# EAGLE design C64 24-28 ROM Adapter NEW (EAGLE 9.6.2)
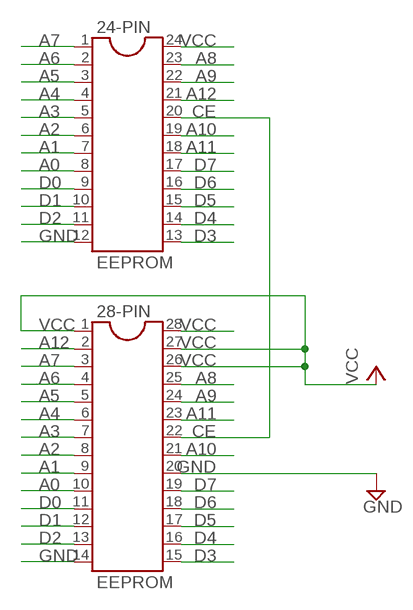
[diagram p0: schematic, sheet 1]

## Parts
24-PIN  EEPROM  DIL24-4  [DIL24-4]
28-PIN  EEPROM  DIL28-4  [DIL28-4]

## Nets
A0: 24-PIN.8 28-PIN.10
A1: 24-PIN.7 28-PIN.9
A2: 24-PIN.6 28-PIN.8
A3: 24-PIN.5 28-PIN.7
A4: 24-PIN.4 28-PIN.6
A5: 24-PIN.3 28-PIN.5
A6: 24-PIN.2 28-PIN.4
A7: 24-PIN.1 28-PIN.3
A8: 24-PIN.23 28-PIN.25
A9: 24-PIN.22 28-PIN.24
A10: 24-PIN.19 28-PIN.21
A11: 24-PIN.18 28-PIN.23
A12: 24-PIN.21 28-PIN.2
CE: 24-PIN.20 28-PIN.22
D0: 24-PIN.9 28-PIN.11
D1: 24-PIN.10 28-PIN.12
D2: 24-PIN.11 28-PIN.13
D3: 24-PIN.13 28-PIN.15
D4: 24-PIN.14 28-PIN.16
D5: 24-PIN.15 28-PIN.17
D6: 24-PIN.16 28-PIN.18
D7: 24-PIN.17 28-PIN.19
GND: 24-PIN.12 28-PIN.14 28-PIN.20
VCC: 24-PIN.24 28-PIN.1 28-PIN.26 28-PIN.27 28-PIN.28

## Library data of the parts
24-PIN = ic-package:DIL24: Dual In Line
28-PIN = ic-package:DIL28: Dual In Line

## Board
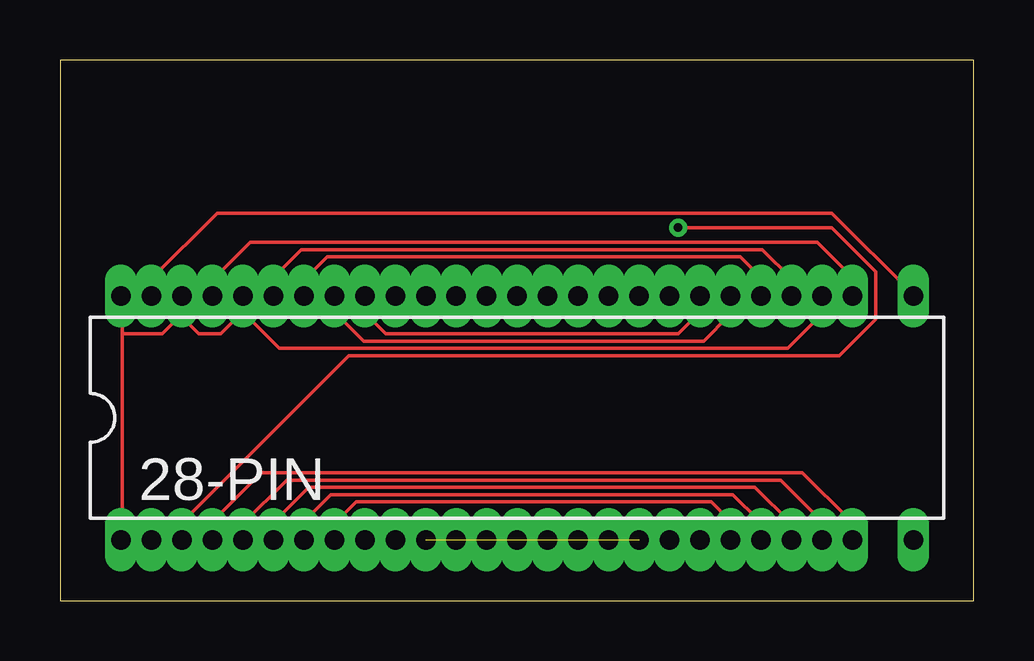
[diagram p1: board, top side]
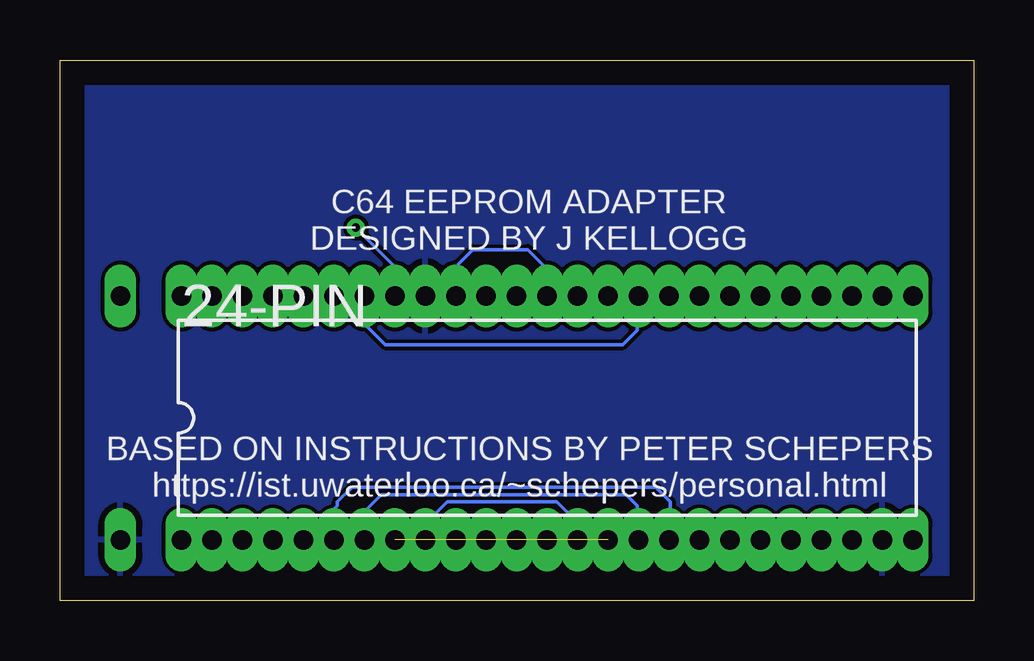
[diagram p2: board, bottom side, seen from below]

Size 38.08 x 22.53 mm. Coordinates in mm from the lower left corner, seen from the top.
Outline: 0,0 38.08,0 38.08,22.53 0,22.53 0,0
Copper layers (1*16): Top 0.035mm / dielectric 1.5mm / Bottom 0.035mm
Design rules "default": minimum track width 6mil, minimum drill 0.35mm, track to track 6mil, track to pad 6mil, pad to pad 6mil, via to via 6mil, smd to smd 6mil, copper to edge 40mil, drill to drill 6mil, minimum pad ring 10mil, minimum via ring 8mil, stop-mask expansion 4mil, vias tented up to drill 0mil, thermal gap 10mil

### Footprints (pad centres in the part's own frame; a part is rotated, then mirrored left to right if it is on the bottom)
DIL24-4 = drill 0.813 long: 1 -13.97,-5.08; 2 -11.43,-5.08; 3 -8.89,-5.08; 4 -6.35,-5.08; 5 -3.81,-5.08; 6 -1.27,-5.08; 7 1.27,-5.08; 8 3.81,-5.08; 9 6.35,-5.08; 10 8.89,-5.08; 11 11.43,-5.08; 12 13.97,-5.08; 13 13.97,5.08; 14 11.43,5.08; 15 8.89,5.08; 16 6.35,5.08; 17 3.81,5.08; 18 1.27,5.08; 19 -1.27,5.08; 20 -3.81,5.08; 21 -6.35,5.08; 22 -8.89,5.08; 23 -11.43,5.08; 24 -13.97,5.08
DIL28-4 = drill 0.813 long: 1 -16.51,-5.08; 2 -13.97,-5.08; 3 -11.43,-5.08; 4 -8.89,-5.08; 5 -6.35,-5.08; 6 -3.81,-5.08; 7 -1.27,-5.08; 8 1.27,-5.08; 9 3.81,-5.08; 10 6.35,-5.08; 11 8.89,-5.08; 12 11.43,-5.08; 13 13.97,-5.08; 14 16.51,-5.08; 15 16.51,5.08; 16 13.97,5.08; 17 11.43,5.08; 18 8.89,5.08; 19 6.35,5.08; 20 3.81,5.08; 21 1.27,5.08; 22 -1.27,5.08; 23 -3.81,5.08; 24 -6.35,5.08; 25 -8.89,5.08; 26 -11.43,5.08; 27 -13.97,5.08; 28 -16.51,5.08

### Placement (x,y rotation side)
24-PIN  17.78,7.62 0 bottom
28-PIN  19.05,7.62 0 top

### Tracks (layer width: path | path; a pad name or v marks a point on that pad's centre or on a via)
A0
  Bottom 0.152: 24-PIN.8 14.02,2.59 14.02,3.96 14.48,4.42 24.69,4.42 25.3,3.81 25.3,2.59 28-PIN.10
A1
  Bottom 0.152: 28-PIN.9 22.86,3.2 21.95,4.12 17.37,4.12 16.61,3.35 16.61,2.59 24-PIN.7
A2
  Top 0.152: 24-PIN.6 19.05,2.59 20.27,2.59 28-PIN.8
A3  (1 unrouted)
A4  (1 unrouted)
A5
  Bottom 0.152: 24-PIN.3 26.67,3.81 26.52,3.96 26.52,4.12 25.91,4.72 13.26,4.72 12.65,4.12 12.65,2.59 28-PIN.5
A6
  Top 0.152: 28-PIN.4 10.21,2.59 10.21,3.35 11.28,4.42 28.04,4.42 29.11,3.35 29.11,2.59 24-PIN.2
A7
  Top 0.152: 28-PIN.3 7.62,3.2 9.45,5.03 30.02,5.03 31.7,3.35 31.7,2.59 24-PIN.1
A8
  Top 0.152: 28-PIN.25 10.21,12.8 10.21,13.41 11.12,14.33 28.35,14.33 29.11,13.56 29.11,12.8 24-PIN.23
A9
  Top 0.152: 24-PIN.22 26.67,12.04 25.76,11.12 13.56,11.12 12.8,11.89 12.8,12.65 28-PIN.24
A10
  Top 0.152: 24-PIN.19 19.05,12.8 20.27,12.8 28-PIN.21
A11
  Top 0.152: 28-PIN.23 15.24,12.8 16.46,12.8 24-PIN.18
A12  (via drill 0.35)
  Top 0.152: v25.76,15.54 32.16,15.54 33.98,13.72 33.98,11.73 32.46,10.21 12.04,10.21 5.18,3.35 5.18,2.59 28-PIN.2
  Bottom 0.152: v25.76,15.54 24.23,14.02 24.23,12.8 24-PIN.21
CE
  Bottom 0.152: 28-PIN.22 17.83,12.8 17.83,13.87 18.59,14.63 20.88,14.63 21.49,14.02 21.49,12.8 24-PIN.20
D0
  Top 0.152: 24-PIN.9 11.43,3.2 12.34,4.12 27.13,4.12 27.89,3.35 27.89,2.59 28-PIN.11
D1
  Top 0.152: 28-PIN.12 30.48,3.2 28.96,4.72 10.36,4.72 8.99,3.35 8.99,2.59 24-PIN.10
D2
  Top 0.152: 24-PIN.11 6.4,2.59 6.4,3.35 8.38,5.33 30.94,5.33 32.92,3.35 32.92,2.59 28-PIN.13
D3
  Top 0.152: 24-PIN.13 3.81,13.41 6.55,16.15 32.16,16.15 35.51,12.8 28-PIN.15
D4
  Top 0.152: 24-PIN.14 6.4,12.8 6.4,13.41 7.92,14.94 31.55,14.94 32.92,13.56 32.92,12.8 28-PIN.16
D5
  Top 0.152: 28-PIN.17 30.48,13.41 29.26,14.63 10.06,14.63 8.99,13.56 8.99,12.8 24-PIN.15
D6
  Top 0.152: 24-PIN.16 11.43,12.04 12.65,10.82 26.82,10.82 27.89,11.89 27.89,12.65 28-PIN.18
D7
  Bottom 0.152: 24-PIN.17 14.02,12.65 14.02,11.28 14.63,10.67 24.54,10.67 25.3,11.43 25.3,12.65 28-PIN.19
GND
  pour Bottom (isolate 0): 0,0 38.1,0 38.1,22.86 0,22.86
VCC
  Top 0.152: 2.59,11.12 2.59,12.65 28-PIN.28 | 2.59,11.12 2.59,2.59 28-PIN.1 | 5.03,11.89 5.03,12.65 28-PIN.27 5.03,11.89 | 5.03,11.89 4.27,11.12 2.59,11.12 | 7.62,12.04 28-PIN.26 7.62,12.65 | 7.62,12.04 6.71,11.12 5.79,11.12 5.03,11.89 | 7.62,12.04 9.14,10.52 30.33,10.52 31.7,11.89 31.7,12.65 24-PIN.24

### Text on the board
bPlace: C64 EEPROM ADAPTER / DESIGNED BY J KELLOGG | BASED ON INSTRUCTIONS BY PETER SCHEPERS / https://ist.uwaterloo.ca/~schepers/personal.html
bNames: 24-PIN